# EAGLE schematic meteo (EAGLE 9.2.2)
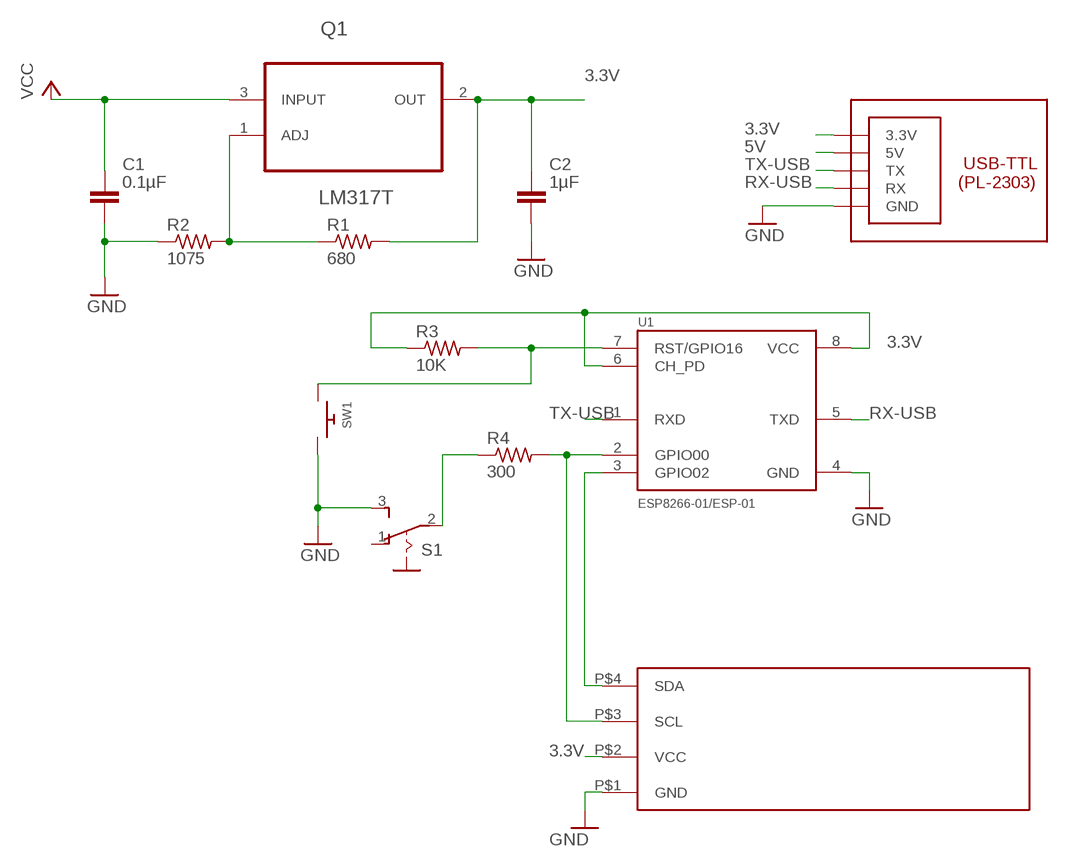
[diagram p0: schematic, sheet 1]

## Parts
C1  0.1µF  C  (no package)
C2  1µF  C  (no package)
Q1  LM317T  [TO254P450X1020X2000-3P]
R1  680  R-US_FLIPFLOP7  [0805-THM-7]
R2  1075  R-US_FLIPFLOP7  [0805-THM-7]
R3  10K  R-US_FLIPFLOP7  [0805-THM-7]
R4  300  R-US_FLIPFLOP7  [0805-THM-7]
S1  M251  [M251]
SW1  SWITCH_PUSHBUTTONSOFTTOUCHSMD_SJ  [PUSHBUTTON_SMD_SJ]
U1  ESP8266-01/ESP-01  [XCVR_ESP8266-01/ESP-01]
U$1  PL2303  (no package)
U$2  OLED  [SIP]

## Nets
3.3V: C2.1 Q1.2(OUT) R1.2 R3.1 U1.6(CH_PD) U1.8(VCC) U$1.3.3V U$2.P$2(VCC)
5V: U$1.5V
GND: C1.2 C2.2 R2.1 S1.3(S) SW1.P$2 U1.4(GND) U$1.GND U$2.P$1(GND)
N$1: Q1.1(ADJ) R1.1 R2.2
N$2: R4.2 U1.2(GPIO00) U$2.P$3(SCL)
N$3: R4.1 S1.2(P)
N$4: U1.3(GPIO02) U$2.P$4(SDA)
N$5: R3.2 SW1.P$1 U1.7(RST/GPIO16)
RX-USB: U1.5(TXD) U$1.RX
TX-USB: U1.1(RXD) U$1.TX
VCC: C1.1 Q1.3(INPUT)
Unconnected: S1.1(O)

## Library data of the parts
C1 C2 = ngspice-simulation:C: CAPACITOR
Q1 = LM317T:LM317T: 1.2 V to 37 V adjustable voltage regulators; AVAILABILITY: Unavailable; MF: Texas Instruments; MP: LM317T; PACKAGE: TO-220-3 HTC Korea; PRICE: None
R1-R4 = adafruit:R-US_: RESISTOR, American symbol
S1 = switch:M251: SLIDING SWITCH Mors, distributor Buerklin, 11G702
SW1 = adafruit:SWITCH_PUSHBUTTON: Buttons SOFTTOUCHSMD_SJ - Soft touch temporary push button (Super Junk Akihabara) Compatible with SKPMANE010 [Mouser: 688-SKPMAN] C&K_KSS = Digikey: KSS221GLFS
U1 = ESP8266-01_ESP-01:ESP8266-01/ESP-01: ESP-01 wifi module; AVAILABILITY: Unavailable; MF: AI-Thinker; MP: ESP8266-01/ESP-01; PACKAGE: None; PRICE: None
U$1 = USB-TTL:PL2303
U$2 = OLED:OLED: I2C 0.91"128x32 OLED